# Altium project Remote Linear Actuator.PrjPcb
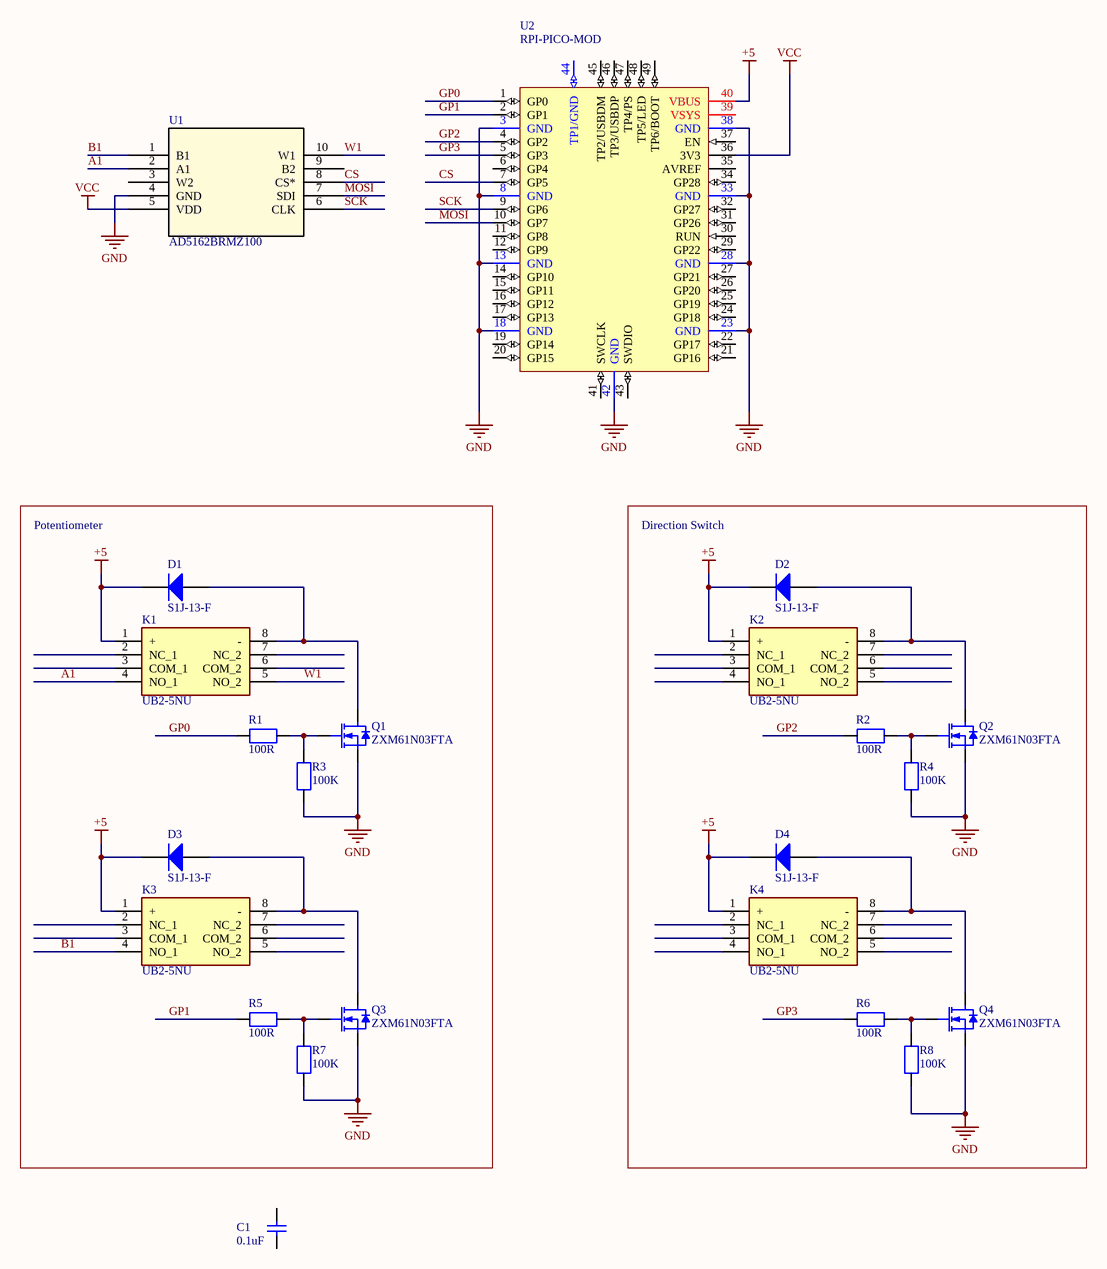
[diagram p0: Remote Linear Actuator.SchDoc]
1 sheet, 23 parts. Net scope: global (net labels, ports and power ports of the same name join across sheets).
Board file: Remote Linear Actuator.PcbDoc

## Sheet Remote Linear Actuator.SchDoc
size A3; SheetNumber: 1; SheetTotal: 1

### Parts
C1  0.1uF  [0603X90]
D1  S1J-13-F  [DIOM-430X270X245]
D2  S1J-13-F  [DIOM-430X270X245]
D3  S1J-13-F  [DIOM-430X270X245]
D4  S1J-13-F  [DIOM-430X270X245]
K1  UB2-5NU  [UB25NU]
K2  UB2-5NU  [UB25NU]
K3  UB2-5NU  [UB25NU]
K4  UB2-5NU  [UB25NU]
Q1  ZXM61N03FTA  [SOT95P240X110-3-1G-2S-3D]
Q2  ZXM61N03FTA  [SOT95P240X110-3-1G-2S-3D]
Q3  ZXM61N03FTA  [SOT95P240X110-3-1G-2S-3D]
Q4  ZXM61N03FTA  [SOT95P240X110-3-1G-2S-3D]
R1  100R  [0805X50]
R2  100R  [0805X50]
R3  100K  [0603X55]
R4  100K  [0603X55]
R5  100R  [0805X50]
R6  100R  [0805X50]
R7  100K  [0603X55]
R8  100K  [0603X55]
U1  AD5162BRMZ100  [RM_10_ADI]
U2  RPI-PICO-MOD  [RPI-PICO-MOD]

### Blocks framed on the sheet
Potentiometer: D1 D3 K1 K3 Q1 Q3 R1 R3 R5 R7
Direction Switch: D2 D4 K2 K4 Q2 Q4 R2 R4 R6 R8

### Nets
+5: D1.K D2.K D3.K D4.K K1.1(+) K2.1(+) K3.1(+) K4.1(+) U2.40(VBUS)
GND: Q1.S Q2.S Q3.S Q4.S R3.2 R4.2 R7.2 R8.2 U1.4(GND) U2.3(GND) U2.8(GND) U2.13(GND) U2.18(GND) U2.23(GND) U2.28(GND) U2.33(GND) U2.38(GND) U2.42(GND)
VCC: U1.5(VDD) U2.36(3V3)
A1: K1.4(NO_1) U1.2(A1)
B1: K3.4(NO_1) U1.1(B1)
CS: U1.8(CS*) U2.7(GP5)
GP0: R1.2 U2.1(GP0)
GP1: R5.2 U2.2(GP1)
GP2: R2.2 U2.4(GP2)
GP3: R6.2 U2.5(GP3)
MOSI: U1.7(SDI) U2.10(GP7)
SCK: U1.6(CLK) U2.9(GP6)
W1: K1.5(NO_2) U1.10(W1)
NetD1_A: D1.A K1.8(-) Q1.D
NetD2_A: D2.A K2.8(-) Q2.D
NetD3_A: D3.A K3.8(-) Q3.D
NetD4_A: D4.A K4.8(-) Q4.D
NetQ1_G: Q1.G R1.1 R3.1
NetQ2_G: Q2.G R2.1 R4.1
NetQ3_G: Q3.G R5.1 R7.1
NetQ4_G: Q4.G R6.1 R8.1

Not connected (* = marked no-connect by the designer): C1 1 2; K1 2(NC_1) 3(COM_1) 6(COM_2) 7(NC_2); K2 2(NC_1) 3(COM_1) 4(NO_1) 5(NO_2) 6(COM_2) 7(NC_2); K3 2(NC_1) 3(COM_1) 5(NO_2) 6(COM_2) 7(NC_2); K4 2(NC_1) 3(COM_1) 4(NO_1) 5(NO_2) 6(COM_2) 7(NC_2); U1 3(W2) 9(B2); U2 6(GP4) 11(GP8) 12(GP9) 14(GP10) 15(GP11) 16(GP12) 17(GP13) 19(GP14) 20(GP15) 21(GP16) 22(GP17) 24(GP18) 25(GP19) 26(GP20) 27(GP21) 29(GP22) 30(RUN) 31(GP26) 32(GP27) 34(GP28) 35(AVREF) 37(EN) 39(VSYS) 41(SWCLK) 43(SWDIO) 44(TP1/GND) 45(TP2/USBDM) 46(TP3/USBDP) 47(TP4/PS) 48(TP5/LED) 49(TP6/BOOT)

### Library data of the parts
C1 = CAP: 0.1uf, 50V,0603; Manufacturer: Yageo; ManufacturerPart: CC0603KRX7R9BB104; AllowSubstitute: Yes; SupplierPart: 311-1344-6-ND; Supplier: Digi-Key
D1-D4 = Diode: DIODE GEN PURP 600V 1A SMA; Manufacturer: Diodes Incorporated; AllowSubstitute: No; SupplierPart: S1J-FDICT-ND; ManufacturerPart: S1J-13-F; PartDescription: DIODE GEN PURP 600V 1A SMA; Supplier: Digi-Key
K1-K4 = UB2-5NU: Relay or Contactor; Manufacturer_Name: Kemet; Datasheet Link: https://datasheet.datasheetarchive.com/originals/distributors/DKDS-28/541666.pdf; Height: 8.8mm; Manufacturer_Part_Number: UB2-5NU
Q1-Q4 = MOSFET-N: 30V N-CHANNEL ENHANCEMENT MODE MOSFET; Manufacturer: Zetex; AllowSubstitute: No; SupplierPart: ZXM61N03FCT-ND; ManufacturerPart: ZXM61N03FTA; Supplier: Digi-Key; PartDescription: 30V N-CHANNEL ENHANCEMENT MODE MOSFET
R1 R2 R5 R6 = RES: 100R 0805; Manufacturer: Yageo; ManufacturerPart: RC0805FR-07150RL; AllowSubstitute: Yes; SupplierPart: 311-150CRCT-ND; Supplier: Digi-Key
R3 R4 R7 R8 = RES: RES SMD 100K OHM 1% 1/10W 0603; Manufacturer: Yageo; ManufacturerPart: RC0603FR-07100KL; AllowSubstitute: Yes; SupplierPart: 311-100KHRCT-ND; PartDescription: RES SMD 100K OHM 1% 1/10W 0603; Supplier: Digi-Key; ClassName: UnderCan
U1 = AD5162BRMZ100: No Description Available; Mfr_Name: Analog Devices Inc; Copyright: Copyright (C) 2022 Ultra Librarian. All rights reserved.; Manufacturer_Part_Number: AD5162BRMZ100; Digi-Key_Part_Number_1: AD5162BRMZ100-ND; Digi-Key_Part_Number_2: 2156-AD5162BRMZ100-ND; RefDes: RefDes; Type: DEV
U2 = RPI-PICO-MOD: RASPBERRY PI PICO RP2040 BOARD; Manufacturer: Raspberry Pi Foundation; Manufacturer Part No: SC0915; Mounting Technology: SMT; Supplier: DigiKey; Supplier Part No: 2648-SC0915CT-ND; Supplier Link: https://www.digikey.com/en/products/detail/raspberry-pi/SC0915/13684020